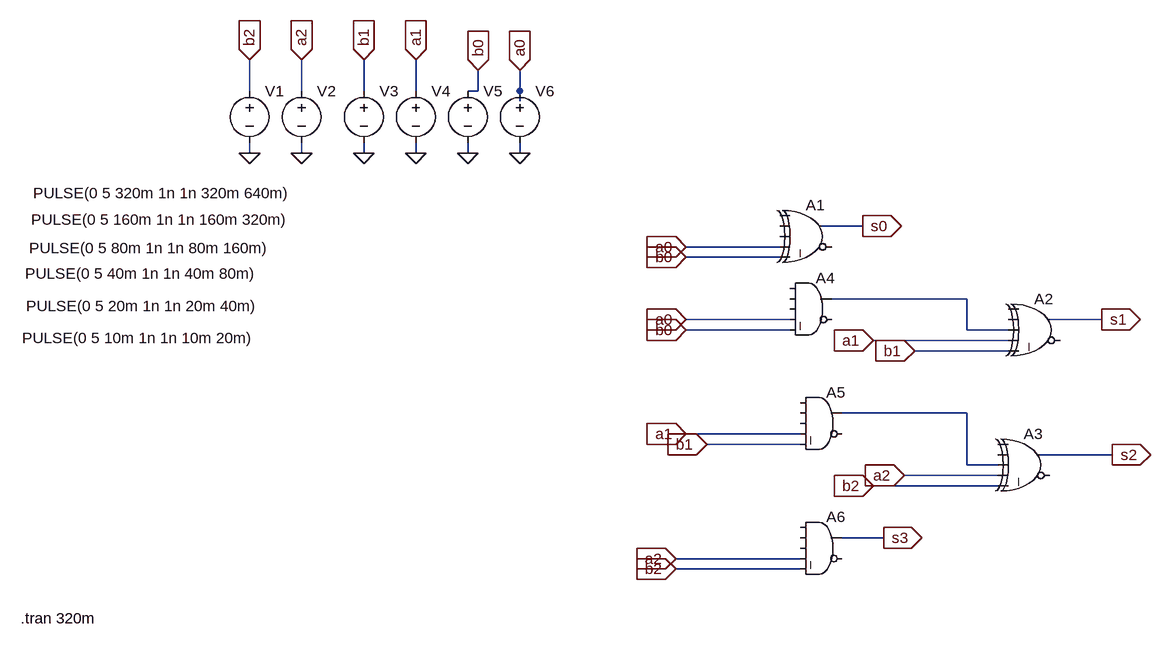
[diagram p0: schematic threebit adder.asc]
threebit adder.asc, the LTspice schematic file:
Version 4
SHEET 1 1272 892
WIRE -144 64 -144 16
WIRE -64 64 -64 16
WIRE 32 64 32 16
WIRE 112 64 112 16
WIRE 208 64 208 32
WIRE 208 64 192 64
WIRE 272 64 272 32
WIRE 272 80 272 64
WIRE -144 160 -144 144
WIRE -64 160 -64 144
WIRE 32 160 32 144
WIRE 112 160 112 144
WIRE 192 160 192 144
WIRE 272 160 272 144
WIRE 800 272 736 272
WIRE 672 304 528 304
WIRE 672 320 528 320
WIRE 960 384 752 384
WIRE 688 416 528 416
WIRE 1168 416 1088 416
WIRE 688 432 528 432
WIRE 960 432 960 384
WIRE 1024 432 960 432
WIRE 1024 448 816 448
WIRE 1024 464 880 464
WIRE 960 560 768 560
WIRE 704 592 528 592
WIRE 704 608 560 608
WIRE 1184 624 1072 624
WIRE 960 640 960 560
WIRE 1008 640 960 640
WIRE 1008 656 864 656
WIRE 1008 672 816 672
WIRE 832 752 768 752
WIRE 704 784 512 784
WIRE 704 800 512 800
FLAG 192 160 0
FLAG 112 160 0
FLAG 32 160 0
FLAG -64 160 0
FLAG -144 160 0
FLAG 272 160 0
FLAG 272 32 a0
IOPIN 272 32 In
FLAG 208 32 b0
IOPIN 208 32 In
FLAG 32 16 b1
IOPIN 32 16 In
FLAG -144 16 b2
IOPIN -144 16 In
FLAG 112 16 a1
IOPIN 112 16 In
FLAG -64 16 a2
IOPIN -64 16 In
FLAG 528 304 a0
IOPIN 528 304 In
FLAG 528 416 a0
IOPIN 528 416 In
FLAG 512 784 a2
IOPIN 512 784 In
FLAG 528 592 a1
IOPIN 528 592 In
FLAG 528 320 b0
IOPIN 528 320 In
FLAG 528 432 b0
IOPIN 528 432 In
FLAG 560 608 b1
IOPIN 560 608 In
FLAG 512 800 b2
IOPIN 512 800 In
FLAG 800 272 s0
IOPIN 800 272 Out
FLAG 832 752 s3
IOPIN 832 752 Out
FLAG 1184 624 s2
IOPIN 1184 624 Out
FLAG 1168 416 s1
IOPIN 1168 416 Out
FLAG 816 448 a1
IOPIN 816 448 In
FLAG 864 656 a2
IOPIN 864 656 In
FLAG 880 464 b1
IOPIN 880 464 In
FLAG 816 672 b2
IOPIN 816 672 In
SYMBOL voltage -144 48 R0
WINDOW 3 -333 173 Left 2
WINDOW 123 0 0 Left 0
WINDOW 39 0 0 Left 0
SYMATTR InstName V1
SYMATTR Value PULSE(0 5 320m 1n 1n 320m 640m)
SYMBOL voltage -64 48 R0
WINDOW 3 -416 214 Left 2
WINDOW 123 0 0 Left 0
WINDOW 39 0 0 Left 0
SYMATTR InstName V2
SYMATTR Value PULSE(0 5 160m 1n 1n 160m 320m)
SYMBOL voltage 32 48 R0
WINDOW 3 -515 258 Left 2
WINDOW 123 0 0 Left 0
WINDOW 39 0 0 Left 0
SYMATTR InstName V3
SYMATTR Value PULSE(0 5 80m 1n 1n 80m 160m)
SYMBOL voltage 112 48 R0
WINDOW 3 -601 297 Left 2
WINDOW 123 0 0 Left 0
WINDOW 39 0 0 Left 0
SYMATTR InstName V4
SYMATTR Value PULSE(0 5 40m 1n 1n 40m 80m)
SYMBOL voltage 192 48 R0
WINDOW 3 -680 347 Left 2
WINDOW 123 0 0 Left 0
WINDOW 39 0 0 Left 0
SYMATTR InstName V5
SYMATTR Value PULSE(0 5 20m 1n 1n 20m 40m)
SYMBOL voltage 272 48 R0
WINDOW 3 -766 396 Left 2
WINDOW 123 0 0 Left 0
WINDOW 39 0 0 Left 0
SYMATTR InstName V6
SYMATTR Value PULSE(0 5 10m 1n 1n 10m 20m)
SYMBOL Digital\\xor 720 224 R0
SYMATTR InstName A1
SYMBOL Digital\\xor 1072 368 R0
SYMATTR InstName A2
SYMBOL Digital\\and 720 336 R0
SYMATTR InstName A4
SYMBOL Digital\\and 736 512 R0
SYMATTR InstName A5
SYMBOL Digital\\and 736 704 R0
SYMATTR InstName A6
SYMBOL Digital\\xor 1056 576 R0
SYMATTR InstName A3
TEXT -496 876 Left 2 !.tran 320m

The netlist it stands for:
* threebit adder.asc
V1 b2 0 PULSE(0 5 320m 1n 1n 320m 640m)
V2 a2 0 PULSE(0 5 160m 1n 1n 160m 320m)
V3 b1 0 PULSE(0 5 80m 1n 1n 80m 160m)
V4 a1 0 PULSE(0 5 40m 1n 1n 40m 80m)
V5 b0 0 PULSE(0 5 20m 1n 1n 20m 40m)
V6 a0 0 PULSE(0 5 10m 1n 1n 10m 20m)
A1 0 0 0 a0 b0 0 s0 0 XOR
A2 0 0 N001 a1 b1 0 s1 0 XOR
A4 0 0 0 a0 b0 0 N001 0 AND
A5 0 0 0 a1 b1 0 N002 0 AND
A6 0 0 0 a2 b2 0 s3 0 AND
A3 0 0 N002 a2 b2 0 s2 0 XOR
.tran 320m
.backanno
.end